# EAGLE design SparkFun_ProMicro_RP2350 (EAGLE 9.6.2)
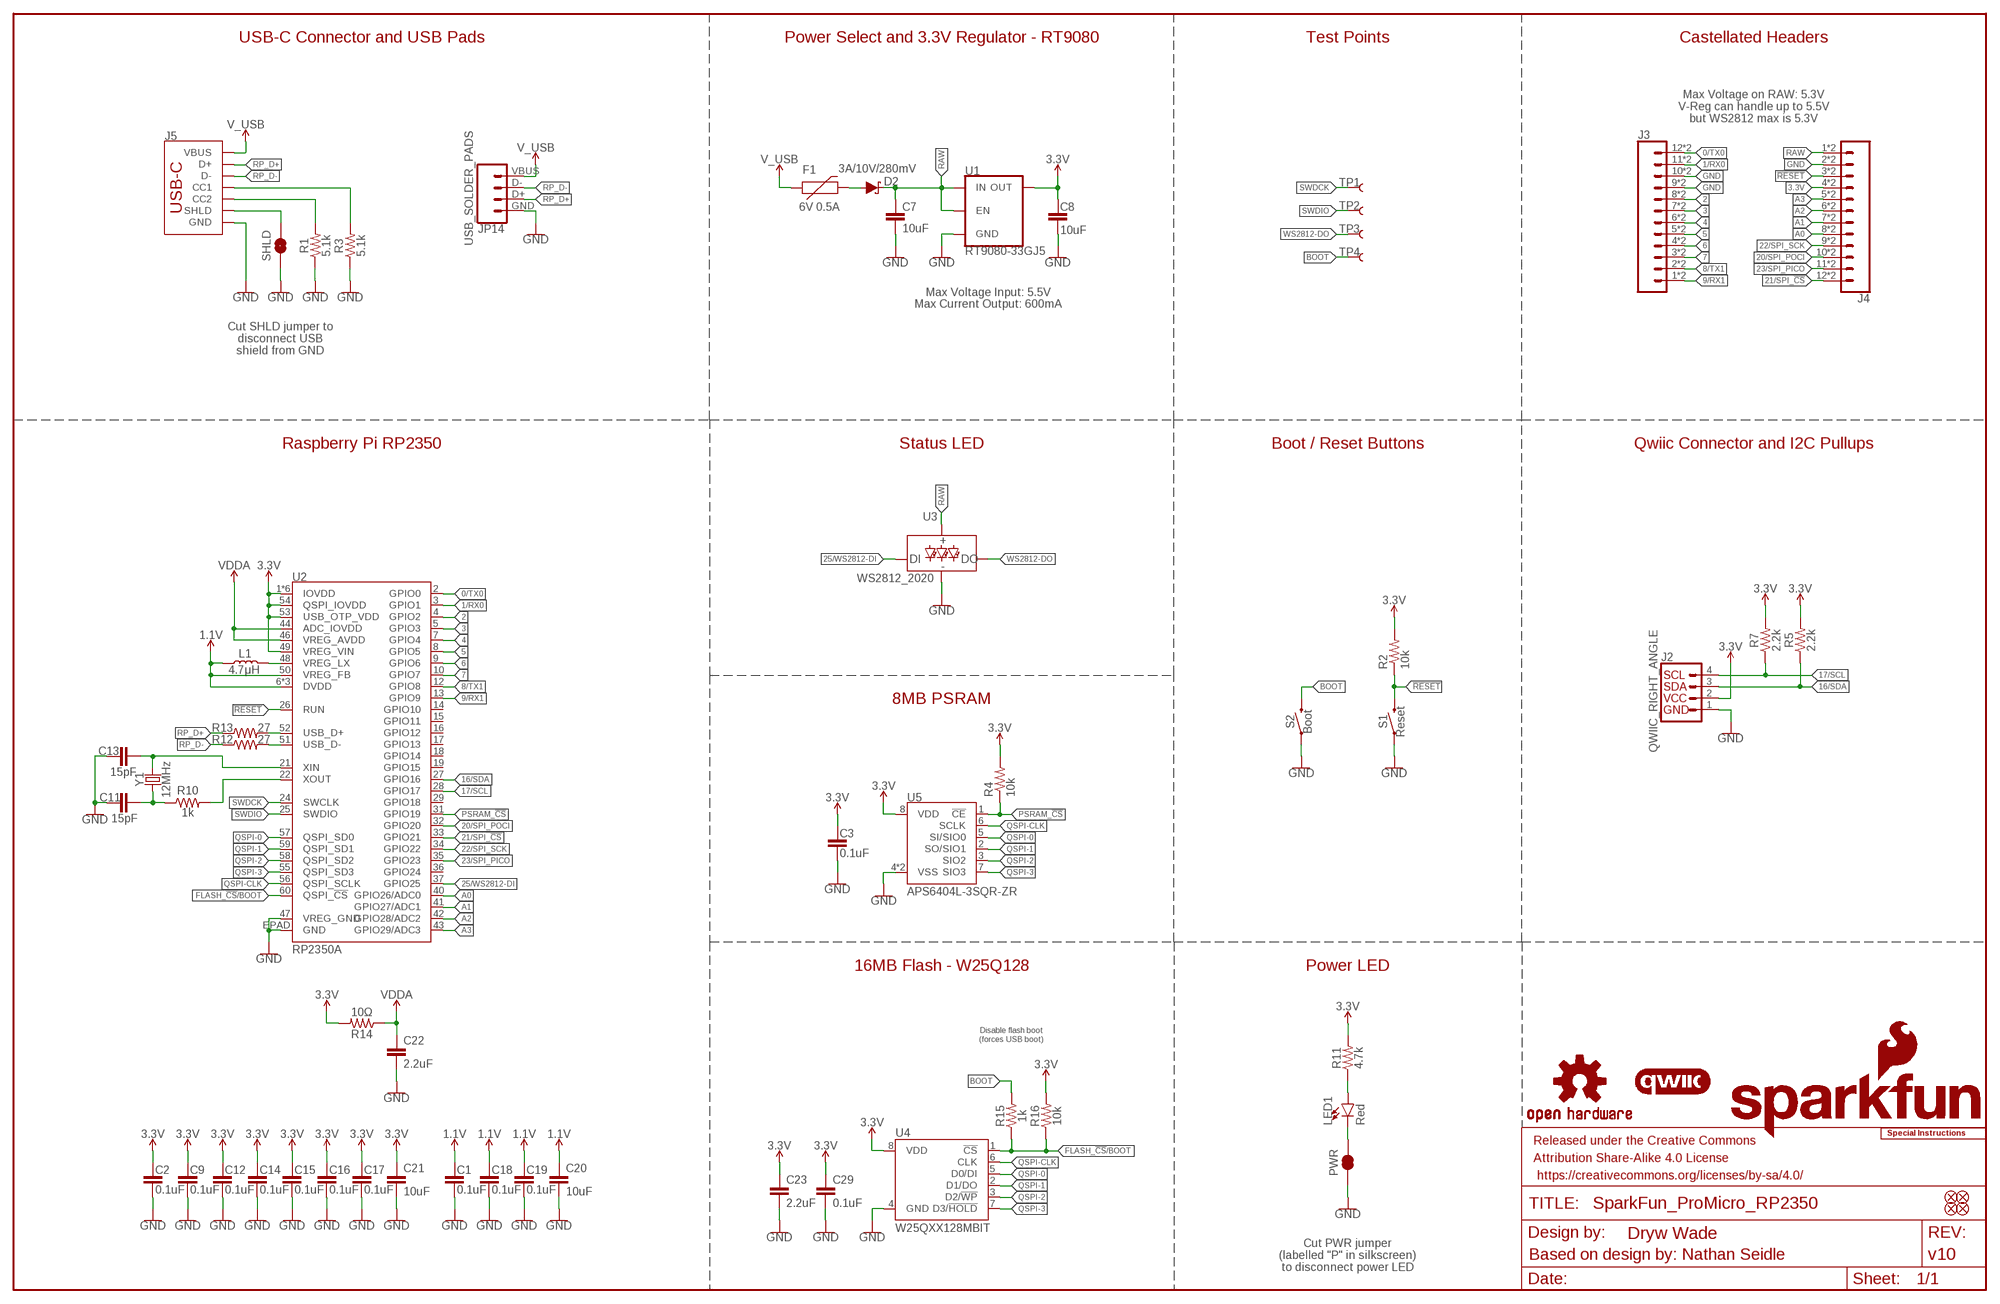
[diagram p0: schematic, sheet 1]

## Parts
C1  0.1uF  0.1UF-0402T-6.3V-10%-X7R  [0402-TIGHT]
C2  0.1uF  0.1UF-0402T-6.3V-10%-X7R  [0402-TIGHT]
C3  0.1uF  0.1UF-0402T-6.3V-10%-X7R  [0402-TIGHT]
C7  10uF  10UF-0402T-6.3V-20%  [0402-TIGHT]
C8  10uF  10UF-0402T-6.3V-20%  [0402-TIGHT]
C9  0.1uF  0.1UF-0402T-6.3V-10%-X7R  [0402-TIGHT]
C11  15pF  15PF-0402T-50V-5%  [0402-TIGHT]
C12  0.1uF  0.1UF-0402T-6.3V-10%-X7R  [0402-TIGHT]
C13  15pF  15PF-0402T-50V-5%  [0402-TIGHT]
C14  0.1uF  0.1UF-0402T-6.3V-10%-X7R  [0402-TIGHT]
C15  0.1uF  0.1UF-0402T-6.3V-10%-X7R  [0402-TIGHT]
C16  0.1uF  0.1UF-0402T-6.3V-10%-X7R  [0402-TIGHT]
C17  0.1uF  0.1UF-0402T-6.3V-10%-X7R  [0402-TIGHT]
C18  0.1uF  0.1UF-0402T-6.3V-10%-X7R  [0402-TIGHT]
C19  0.1uF  0.1UF-0402T-6.3V-10%-X7R  [0402-TIGHT]
C20  10uF  10UF-0402T-6.3V-20%  [0402-TIGHT]
C21  10uF  10UF-0402T-6.3V-20%  [0402-TIGHT]
C22  2.2uF  2.2UF-0402_TIGHT-10V-10%-X5R  [0402-TIGHT]
C23  2.2uF  2.2UF-0402_TIGHT-10V-10%-X5R  [0402-TIGHT]
C29  0.1uF  0.1UF-0402T-6.3V-10%-X7R  [0402-TIGHT]
D2  3A/10V/280mV  DIODE-SCHOTTKY-BAT60A  [SOD-323]
F1  6V 0.5A  PPTC_6V500MA  [0805]
FRAME2  FRAME-LEDGER  [CREATIVE_COMMONS]
J2  QWIIC_RIGHT_ANGLE  QWIIC_CONNECTORJS-1MM  [JST04_1MM_RA]
J3  CONN_12CASTELLATED  [1X12_CASTELLATED]
J4  CONN_12CASTELLATED  [1X12_CASTELLATED]
J5  USB Female Type C Connector  USB_C_4-LAYER_PADS  [USB-C-16P_4LAYER-PADS]
JP1  FIDUCIAL1X2  [FIDUCIAL-1X2]
JP2  FIDUCIAL1X2  [FIDUCIAL-1X2]
JP3  FIDUCIAL1X2  [FIDUCIAL-1X2]
JP4  FIDUCIAL1X2  [FIDUCIAL-1X2]
JP14  USB_SOLDER_PADS  [USB-SOLDER-PADS]
L1  4.7μH  4.7μH_SHIELDED_INDUCTOR  [1008(2520)]
LED1  Red  LED-RED_0603-KB  [LED-0603]
LOGO1  SFE_LOGO_NAME_FLAME.1_INCH  [SFE_LOGO_NAME_FLAME_.1]
LOGO3  QWIIC_LOGO_6MM  [QWIIC_6MM]
LOGO4  SFE_LOGO_FLAME.1_INCH  [SFE_LOGO_FLAME_.1]
LOGO5  SPECIAL_INSTRUCTIONS-ORDERING  [ORDERING_INSTRUCTIONS]
PWR  JUMPER-SMT_2_NC_TRACE_SILK  [SMT-JUMPER_2_NC_TRACE_SILK]
R1  5.1k  5.1KOHM-0402T-1/16W-1%  [0402-TIGHT]
R2  10k  10KOHM-0402T-1/16W-1%  [0402-TIGHT]
R3  5.1k  5.1KOHM-0402T-1/16W-1%  [0402-TIGHT]
R4  10k  10KOHM-0402T-1/16W-1%  [0402-TIGHT]
R5  2.2k  2.2KOHM-0402T-1/16W-1%  [0402-TIGHT]
R7  2.2k  2.2KOHM-0402T-1/16W-1%  [0402-TIGHT]
R10  1k  1KOHM-0402T-1/16W-1%  [0402-TIGHT]
R11  4.7k  4.7KOHM-0402T-1/16W-1%  [0402-TIGHT]
R12  27  27OHM  [0402-TIGHT]
R13  27  27OHM  [0402-TIGHT]
R14  10Ω  10OHM-0402-1/16W-5%  [0402-TIGHT]
R15  1k  1KOHM-0402T-1/16W-1%  [0402-TIGHT]
R16  10k  10KOHM-0402T-1/16W-1%  [0402-TIGHT]
S1  Reset  MOMENTARY-SWITCH-SPST-SMD-4.6X2.8MM  [TACTILE_SWITCH_SMD_4.6X2.8MM]
S2  Boot  MOMENTARY-SWITCH-SPST-SMD-4.6X2.8MM  [TACTILE_SWITCH_SMD_4.6X2.8MM]
SHLD  JUMPER-SMT_2_NC_TRACE_SILK  [SMT-JUMPER_2_NC_TRACE_SILK]
TP1  TEST-POINT3X5  [PAD.03X.05]
TP2  TEST-POINT3X5  [PAD.03X.05]
TP3  TEST-POINT3X5  [PAD.03X.05]
TP4  TEST-POINT3X5  [PAD.03X.05]
U1  RT9080-33GJ5  V_REG_RT9080-33GJ5  [SOT23-5]
U2  RP2350A  [RP2350A]
U3  WS2812_2020  [WS2812-2020]
U4  W25QXX128MBIT  W25QXX128MBIT-6X5-SKINNY_CENTER  [WSON-8-6X5-SKINNY_CENTERPAD]
U5  APS6404L-3SQR-ZR  [APS6404L-3SQR-ZR]
U$3  OSHW-LOGOMINI  [OSHW-LOGO-MINI]
Y1  12MHz  CRYSTAL-12MHZ  [CRYSTAL-SMD-2X2.5MM]

## Nets
0/TX0: J3.12 J3.12B U2.2(GPIO0)
1.1V: C1.1 C18.1 C19.1 C20.1 L1.1 U2.6(DVDD) U2.23(DVDD) U2.39(DVDD) U2.50(VREG_FB)
1/RX0: J3.11 J3.11B U2.3(GPIO1)
2: J3.8 J3.8B U2.4(GPIO2)
3: J3.7 J3.7B U2.5(GPIO3)
3.3V: C2.1 C3.1 C8.2 C9.1 C12.1 C14.1 C15.1 C16.1 C17.1 C21.1 C23.1 C29.1 J2.2 J4.4 J4.4B R2.2 R4.2 R5.2 R7.2 R11.2 R14.2 R16.2 U1.5(OUT) U2.1(IOVDD) U2.11(IOVDD) U2.20(IOVDD) U2.30(IOVDD) U2.38(IOVDD) U2.45(IOVDD) U2.49(VREG_VIN) U2.53(USB_OTP_VDD) U2.54(QSPI_IOVDD) U4.8(VDD) U5.8(VDD)
4: J3.6 J3.6B U2.7(GPIO4)
5: J3.5 J3.5B U2.8(GPIO5)
6: J3.4 J3.4B U2.9(GPIO6)
7: J3.3 J3.3B U2.10(GPIO7)
8/TX1: J3.2 J3.2B U2.12(GPIO8)
9/RX1: J3.1 J3.1B U2.13(GPIO9)
16/SDA: J2.3 R5.1 U2.27(GPIO16)
17/SCL: J2.4 R7.1 U2.28(GPIO17)
20/SPI_POCI: J4.10 J4.10B U2.32(GPIO20)
21/SPI_!CS!: J4.12 J4.12B U2.33(GPIO21)
22/SPI_SCK: J4.9 J4.9B U2.34(GPIO22)
23/SPI_PICO: J4.11 J4.11B U2.35(GPIO23)
25/WS2812-DI: U2.37(GPIO25) U3.DI
!RESET!: J4.3 J4.3B R2.1 S1.3 S1.4 U2.26(RUN)
A0: J4.8 J4.8B U2.40(GPIO26/ADC0)
A1: J4.7 J4.7B U2.41(GPIO27/ADC1)
A2: J4.6 J4.6B U2.42(GPIO28/ADC2)
A3: J4.5 J4.5B U2.43(GPIO29/ADC3)
BOOT: R15.2 S2.3 S2.4 TP4.1
FLASH_!CS!/BOOT: R15.1 R16.1 U2.60(QSPI_!CS!) U4.1(!CS!)
GND: C1.2 C2.2 C3.2 C7.1 C8.1 C9.2 C11.1 C12.2 C13.1 C14.2 C15.2 C16.2 C17.2 C18.2 C19.2 C20.2 C21.2 C22.2 C23.2 C29.2 J2.1 J3.9 J3.9B J3.10 J3.10B J4.2 J4.2B J5.GND J5.GND2(GND) JP14.GND PWR.1 R1.1 R3.1 S1.1 S1.2 S2.1 S2.2 SHLD.2 U1.2(GND) U2.47(VREG_GND) U2.EPAD(GND) U3.GND U4.4(GND) U5.4(VSS) U5.9(VSS)
N$2: L1.2 U2.48(VREG_LX)
N$3: LED1.C PWR.2
N$9: J5.A5(CC1) R3.2
N$10: J5.B5(CC2) R1.2
N$38: LED1.A R11.1
PSRAM_!CS!: R4.1 U2.31(GPIO19) U5.1(!CE!)
QSPI-0: U2.57(QSPI_SD0) U4.5(D0/DI) U5.5(SI/SIO0)
QSPI-1: U2.59(QSPI_SD1) U4.2(D1/DO) U5.2(SO/SIO1)
QSPI-2: U2.58(QSPI_SD2) U4.3(D2/!WP!) U5.3(SIO2)
QSPI-3: U2.55(QSPI_SD3) U4.7(D3/!HOLD!) U5.7(SIO3)
QSPI-CLK: U2.56(QSPI_SCLK) U4.6(CLK) U5.6(SCLK)
RAW [Power]: C7.2 D2.C J4.1 J4.1B U1.1(IN) U1.3(EN) U3.VCC
RP_D1+: R13.2 U2.52(USB_D+)
RP_D1-: R12.2 U2.51(USB_D-)
RP_D+: J5.A6(D+) J5.B6(D+) JP14.D+ R13.1
RP_D-: J5.A7(D-) J5.B7(D-) JP14.D- R12.1
SHLD: J5.SHLD1(SHLD) J5.SHLD2(SHLD) J5.SHLD3(SHLD) J5.SHLD4(SHLD) SHLD.1
SWDCK: TP1.1 U2.24(SWCLK)
SWDIO: TP2.1 U2.25(SWDIO)
USB_RAW [Power]: D2.A F1.2
V_USB [Power]: F1.1 J5.VBUS1(VBUS) J5.VBUS2(VBUS) JP14.VBUS
VDDA: C22.1 R14.1 U2.44(ADC_IOVDD) U2.46(VREG_AVDD)
WS2812-DO: TP3.1 U3.DO
X1A: R10.2 U2.22(XOUT)
X1B: C11.2 R10.1 Y1.P1
X2: C13.2 U2.21(XIN) Y1.P3
Unconnected: U2.14(GPIO10) U2.15(GPIO11) U2.16(GPIO12) U2.17(GPIO13) U2.18(GPIO14) U2.19(GPIO15) U2.29(GPIO18) U2.36(GPIO24)

## Notes on the sheet
- USB-C Connector and USB Pads | Power Select and 3.3V Regulator - RT9080 | Test Points | Castellated Headers
- Max Voltage on RAW: 5.3V
  V-Reg can handle up to 5.5V
  but WS2812 max is 5.3V
- Max Voltage Input: 5.5V
- Max Current Output: 600mA
- Cut SHLD jumper to
  disconnect USB
  shield from GND
- Raspberry Pi RP2350 | Status LED | Boot / Reset Buttons | Qwiic Connector and I2C Pullups
- 8MB PSRAM
- 16MB Flash - W25Q128 | Power LED
- Disable flash boot
  (forces USB boot)
- Cut PWR jumper
  (labelled "P" in silkscreen)
  to disconnect power LED
- Based on design by: Nathan Seidle

## Library data of the parts
C1-C3 C9 C12 C14-C19 C29 = SparkFun-Capacitors:0.1UF: 0.1µF ceramic capacitors A capacitor is a passive two-terminal electrical component used to store electrical energy temporarily in an electric field.; PROD_ID: CAP-14993
C7 C8 C20 C21 = SparkFun-Capacitors:10UF: 10.0µF ceramic capacitors A capacitor is a passive two-terminal electrical component used to store electrical energy temporarily in an electric field.; PROD_ID: CAP-14848
C11 C13 = SparkFun-Capacitors:15PF: 15pF ceramic capacitors A capacitor is a passive two-terminal electrical component used to store electrical energy temporarily in an electric field.; PROD_ID: CAP-13063
C22 C23 = SparkFun-Capacitors:2.2UF: 2.2µF ceramic capacitors A capacitor is a passive two-terminal electrical component used to store electrical energy temporarily in an electric field.; PROD_ID: CAP-14232
D2 = SparkFun-DiscreteSemi:DIODE-SCHOTTKY: Schottky diode A Schottky diode is a semiconductor diode which has a low forward voltage drop and a very fast switching action.; PROD_ID: DIO-14072
F1 = SparkFun-Fuses:PPTC: Resettable Fuse PPTC Resettable Fuse. Really a sort of resistor with a polymeric positive temperature coefficient whose resistance increases dramatically with an increase in temperature. When heated by the power passing through the resistance rises causing the current to be limited, protecting the circuit. This is achieved by the transition of the polymer from a crystalline to an amorphous state where the conductive carbon separates breaking the conductive pathways found in the cool crystalline structure. When a PPTC cools back down it resumes conducting letting the circuit turn back on. SparkFun Products: SparkFun RedBoard - Programmed with Arduino <https://www.sparkfun.com/products/12757> Pro Micro - 5V/16MHz <https://www.sparkfun.com/products/12640> Arduino Pro 328 - 5V/16MHz <https://www.sparkfun.com/products/10915> MP3 Trigger <https://www.sparkfun.com/products/13720>; PROD_ID: RES-13945
FRAME2 = SparkFun-Aesthetics:FRAME-LEDGER: Schematic Frame - Ledger Standard 11x14 US Ledger frame; DESIGNER: Dryw Wade; REV: v10
J2 = SparkFun-Connectors:QWIIC_CONNECTOR: SparkFun I2C Standard Qwiic Connector An SMD 1mm pitch JST connector makes it easy and quick (get it? Qwiic?) to connect I2C devices to each other. The Qwiic system <http://www.sparkfun.com/qwiic> enables fast and solderless connection between popular platforms and various sensors and actuators. We carry 200mm <https://www.sparkfun.com/products/14204>, 100mm <https://www.sparkfun.com/products/14205>, 50mm <https://www.sparkfun.com/products/14206>, and breadboard friendly <https://www.sparkfun.com/products/14207> Qwiic cables. We also offer 10 pcs strips <https://www.sparkfun.com/products/14323> the SMD connectors.; PROD_ID: CONN-13694
J3 J4 = SparkFun-Connectors:CONN_12: Multi connection point. Often used as Generic Header-pin footprint for 0.1 inch spaced/style header connections On any of the 0.1 inch spaced packages, you can populate with these: Break Away Headers - Straight <https://www.sparkfun.com/products/116> (PRT-00116) Break Away Male Headers - Right Angle <https://www.sparkfun.com/products/553> (PRT-00553) Female Headers <https://www.sparkfun.com/products/115> (PRT-00115) Break Away Headers - Machine Pin <https://www.sparkfun.com/products/117> (PRT-00117) Break Away Female Headers - Swiss Machine Pin <https://www.sparkfun.com/products/743> (PRT-00743) For SCREWTERMINALS and SPRING TERMINALS visit here: Screw Terimnals on SparkFun.com <https://www.sparkfun.com/search/results?term=Screw+Terminals> (5mm/3.5mm/2.54mm spacing) This device is also useful as a general connection point to wire up your design to another part of your project. Our various solder wires solder well into these plated through hole pads. Hook-Up Wire - Assortment (Stranded, 22 AWG) <https://www.sparkfun.com/products/11375> (PRT-11375) Hook-Up Wire - Assortment (Solid Core, 22 AWG) <https://www.sparkfun.com/products/11367> (PRT-11367) View the entire wire category on our website here <https://www.sparkfun.com/categories/141> Special notes: Molex polarized connector foot print use with SKU : PRT-08231 with associated crimp pins and housings. 1MM SMD Version SKU: PRT-10208 NOTES ON THE VARIANTS LOCK and LOCK_LONGPADS... This footprint was designed to help hold the alignment of a through-hole component (i.e. 6-pin header) while soldering it into place. You may notice that each hole has been shifted either up or down by 0.005 of an inch from it's more standard position (which is a perfectly straight line). This slight alteration caused the pins (the squares in the middle) to touch the edges of the holes. Because they are alternating, it causes a "brace" to hold the component in place. 0.005 has proven to be the perfect amount of "off-center" position when using our standard breakaway headers. Although looks a little odd when you look at the bare footprint, once you have a header in there, the alteration is very hard to notice. Also,if you push a header all the way into place, it is covered up entirely on the bottom side.
J5 = SparkFun-Connectors:USB_C: USB Type C 16Pin Connector Super Speed pins not available on the 16-pin purely SMD connector so this part is best for USB 2.0 implementations. D1 and D2 are tied together enabling D+/- no matter which way the cable is plugged into the connector. The two channel configuration pins (CC1/2) are exposed. These are normally connected to ground via 5.1k resistors but can be reconfigured for high current/high power applications. **4-LAYER BOARD WARNING!!** If designing 4-layer board, make sure to select the variant _4-LAYER-ISOLATED. The linked footprint (USB-C-16-4LAYER-ISOLATED) includes some very necessary cutout polygons in the inner layers (2 and 15). This prevents the PTH mounting shield legs on the USB connector from electrically connecting any other polygons on the inner layers (usually VCC and GND).; PROD_ID: CONN-14122
JP1-JP4 = SparkFun-Aesthetics:FIDUCIAL: Fiducial Alignment Points Point-of-reference for pick-and-place machines and other optical instruments.
JP14 = SparkFun-Connectors:USB_SOLDER_PADS: Solder pad access to USB pins. Helpful to expose on PCBs so user can attach external USB connector if necessary.
L1 = SparkFun-Coils:4.7μH_SHIELDED_INDUCTOR: 4.7uH Inductor 4.7uH 1.4A 50mOhm 1008(2520) Package Shielded; PROD_ID: NDUC-14880
LED1 = SparkFun-LED:LED-RED: Red SMD LED Used in manufacturing of most products at SparkFun Packages: 0603 - KB - KingBright (DIO-17976) SMD 0603 package [Datasheet] <https://www.kingbrightusa.com/images/catalog/SPEC/APT1608SURCK.pdf> 0603 - (DIO-00819, has gone EOL) SMD 0603 package 0603 SMART - SMD 0603 SMART package ( more efficient and expensive)[Product Link] <http://www.osram-os.com/Graphics/XPic2/00077099_0.pdf> 1206 - SMD1206 package [Product Link] <https://www.sparkfun.com/datasheets/DevTools/LilyPad/Q150OVS4.pdff> SparkFun Products: Pro Mini 328 -5V <https://www.sparkfun.com/products/821> RedBoard <https://www.sparkfun.com/products/12757> IOIO-OTG <https://www.sparkfun.com/products/13613>; PROD_ID: DIO-17976
LOGO1 = SparkFun-Aesthetics:SFE_LOGO_NAME_FLAME: SparkFun Font Logo w/ Flame This is the SparkFun full logo. The logo on the schematic will always be the same size; the package variant is the height of the flame part of the logo. Default layer for the logo on the board is tSilk.
LOGO3 = SparkFun-Aesthetics:QWIIC_LOGO: Qwiic Logos for placement on schematic and PCB. The 5.5mm silk logo is best for placing next to Qwiic connector.
LOGO4 = SparkFun-Aesthetics:SFE_LOGO_FLAME: SparkFun Flame Logo This is the SparkFun flame logo. The logo on the schematic will always be the same size; the package variant is the height of the flame. Default layer for the logo on the board is tSilk.
LOGO5 = SparkFun-Aesthetics:SPECIAL_INSTRUCTIONS: Special Ordering/Production Instructions Alert Symbol for special PCB ordering instructions or unique production process warnings. Ordering Instructions Production Instructions Types of information that should be added to box: Copper weight Soldermask color Silk color PCB thickness Number of layers PCB Standard: 1.6mm FR4 1 oz copper immersion silver plating red soldermask white silkscreen Types of information that should be added to box: Special wash requirements Depaneling instructions Humidification Glue curing Default text settings: 0.07 inch 9% ratio 50% line distance
PWR SHLD = SparkFun-Jumpers:JUMPER-SMT_2_NC_TRACE: Normally closed trace jumper This jumper has a trace between two pads so it's normally closed (NC). Use a razor knife to open the connection. For best results follow the IPC guidelines for cutting traces: Cutout at least 0.063 mm (0.005 in). Remove all loose material to clean up the cut area. Seal the cut with an approved epoxy. Reapply solder to reclose the connection.
R1 R3 = SparkFun-Resistors:5.1KOHM; PROD_ID: RES-14340
R2 R4 R16 = SparkFun-Resistors:10KOHM: 10kΩ resistor A resistor is a passive two-terminal electrical component that implements electrical resistance as a circuit element. Resistors act to reduce current flow, and, at the same time, act to lower voltage levels within circuits. - Wikipedia; PROD_ID: RES-14241
R5 R7 = SparkFun-Resistors:2.2KOHM: 2.2kΩ resistor A resistor is a passive two-terminal electrical component that implements electrical resistance as a circuit element. Resistors act to reduce current flow, and, at the same time, act to lower voltage levels within circuits. - Wikipedia; PROD_ID: RES-14341
R10 R15 = SparkFun-Resistors:1KOHM: 1kΩ resistor A resistor is a passive two-terminal electrical component that implements electrical resistance as a circuit element. Resistors act to reduce current flow, and, at the same time, act to lower voltage levels within circuits. - Wikipedia; PROD_ID: RES-14342
R11 = SparkFun-Resistors:4.7KOHM: 4.7kΩ resistor A resistor is a passive two-terminal electrical component that implements electrical resistance as a circuit element. Resistors act to reduce current flow, and, at the same time, act to lower voltage levels within circuits. - Wikipedia; PROD_ID: RES-15343
R12 R13 = SparkFun-Resistors:27OHM: 27Ω resistor A resistor is a passive two-terminal electrical component that implements electrical resistance as a circuit element. Resistors act to reduce current flow, and, at the same time, act to lower voltage levels within circuits. - Wikipedia; PROD_ID: RES-15238
R14 = SparkFun-Resistors:10OHM: 10Ω resistor A resistor is a passive two-terminal electrical component that implements electrical resistance as a circuit element. Resistors act to reduce current flow, and, at the same time, act to lower voltage levels within circuits. - Wikipedia; PROD_ID: RES-16072
S1 S2 = SparkFun-Switches:MOMENTARY-SWITCH-SPST: Momentary Switch (Pushbutton) - SPST Normally-open (NO) SPST momentary switches (buttons, pushbuttons). Variants PTH-12MM - 12mm square, through-hole Momentary Pushbutton Switch - 12mm Square <https://www.sparkfun.com/products/9190> (COM-09190) PTH-6.0MM, PTH-6.0MM-KIT - 6.0mm square, through-hole Mini Pushbutton Switch <https://www.sparkfun.com/products/97> (COM-00097) KIT package intended for soldering kit's - only one side of pads' copper is exposed. PTH-RIGHT-ANGLE-KIT - Right-angle, through-hole Right Angle Tactile Button <https://www.sparkfun.com/products/10791> - Used on SparkFun BigTime Watch Kit <https://www.sparkfun.com/products/11734> SMD-12MM - 12mm square, surface-mount Tactile Button - SMD (12mm) <https://www.sparkfun.com/products/12993> (COM-12993) Used on SparkFun PicoBoard <https://www.sparkfun.com/products/11888> SMD-4.5MM - 4.5mm Square Trackball Switch Used on SparkFun Blackberry Trackballer Breakout <https://www.sparkfun.com/products/13169> SMD-4.6MMX2.8MM - 4.60mm x 2.80mm, surface mount Used on SparkFun Pro Micro - RP2040 <https://www.sparkfun.com/products/17717> SMD-5.2MM, SMD-5.2-REDUNDANT - 5.2mm square, surface-mount Mini Pushbutton Switch - SMD <https://www.sparkfun.com/products/8720> (COM-08720) Used on Arduino Pro Mini <https://www.sparkfun.com/products/11114> REDUNDANT package connects both switch circuits together SMD-6.0X3.5MM - 6.0 x 3.5mm, surface mount Momentary Reset Switch SMD <https://www.sparkfun.com/products/8229> (COM-08229) SMD-6.2MM-TALL - 6.2mm square, surface mount Tactile Button - SMD (6mm) <https://www.sparkfun.com/products/12992> Used on SparkFun Digital Sandbox <https://www.sparkfun.com/products/12651> SMD-RIGHT-ANGLE - Right-angle, surface mount Used on SparkFun Block for Intel® Edison - Arduino <https://www.sparkfun.com/products/13036>; PROD_ID: SWCH-15606
TP1-TP4 = SparkFun-Connectors:TEST-POINT: SparkFun Test Points Bare copper test points for troubleshooting or In-Circuit-Testing. These are used by our Production team for verifying production board runs using pogo-pins on test beds. SparkFun Products: SparkFun LSM9DS1 Breakout <https://www.sparkfun.com/products/13284> SparkFun PSOC <https://www.sparkfun.com/products/13714> SparkFun Load Cell Amplifier <https://www.sparkfun.com/products/13879>
U1 = SparkFun-IC-Power:V_REG_RT9080-33GJ5: RT9080-33GJ5 Low-Dropout Linear Regulator The RT9080 is a low-dropout (LDO) voltage regulators with enable function that operates from 1.2V to 5.5V. It provides up to 600mA of output current and offers low-power operation in miniaturized packaging. The features of low quiescent current as low as 2μA and almost zero disable current is ideal for powering the battery equipment to a longer service life. The RT9080 is stable with the ceramic output capacitor over its wide input range from 1.2V to 5.5V and the entire range of output load current (0mA to 600mA). The output for this LDO is 3.3V.; PROD_ID: VREG-19034
U2 = RP2350A:RP2350A; PROD_ID: IC-21276
U3 = SparkFun-LED:WS2812: Addressable RGB LED - 1 Wire Common names: WS2812, SK6812, Neopixel, APA-106, etc. SMD LED with built-in controller IC. Color: Red/Green/Blue SparkFun Products: LED-SMD RGB (WS2812) <https://www.sparkfun.com/products/12661> LED - RGB Addressable, PTH, 5mm Diffused (5 Pack) <https://www.sparkfun.com/products/12986> LED - RGB Addressable, PTH, 5mm Clear (5 Pack) <https://www.sparkfun.com/products/12999> RGB Addressable CBI LED 5mm RA <https://www.sparkfun.com/products/23649> Datasheet referenced for footprint: WS2812B-PTH <https://cdn.sparkfun.com/datasheets/Components/LED/COM-12877.pdf>; PROD_ID: DIO-15591
U4 = SparkFun-IC-Memory:W25QXX; PROD_ID: IC-15107
U5 = RP2350A:APS6404L-3SQR-ZR; PROD_ID: IC-21870
U$3 = SparkFun-Aesthetics:OSHW-LOGO: Open-Source Hardware (OSHW) Logo This logo indicates the piece of hardware it is found on incorporates a OSHW license and/or adheres to the definition of open source hardware found here: http://freedomdefined.org/OSHW
Y1 = SparkFun-Clocks:CRYSTAL-12MHZ: 12.0MHz Crystal Frequency: 12.0MHz Frequency Tolerance: ±20ppm Load Capacitance: 18pF SparkFun Products: SparkFun Logomatic <https://www.sparkfun.com/products/12772> Pocket AVR Programmer <https://www.sparkfun.com/products/9825>; PROD_ID: XTAL-15540

## Net classes
1 Power: width 0.127 mm, clearance 0.178 mm

## Board
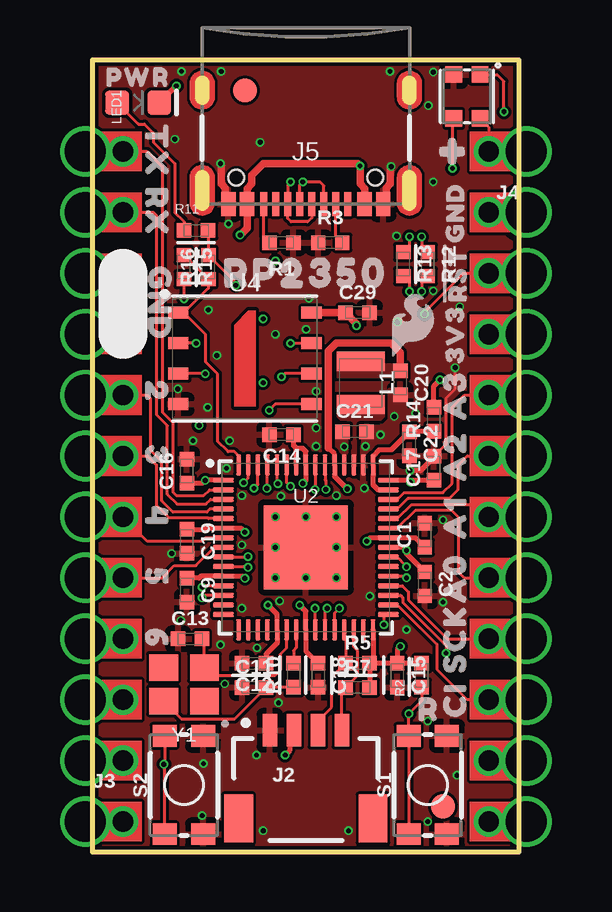
[diagram p1: board, top side]
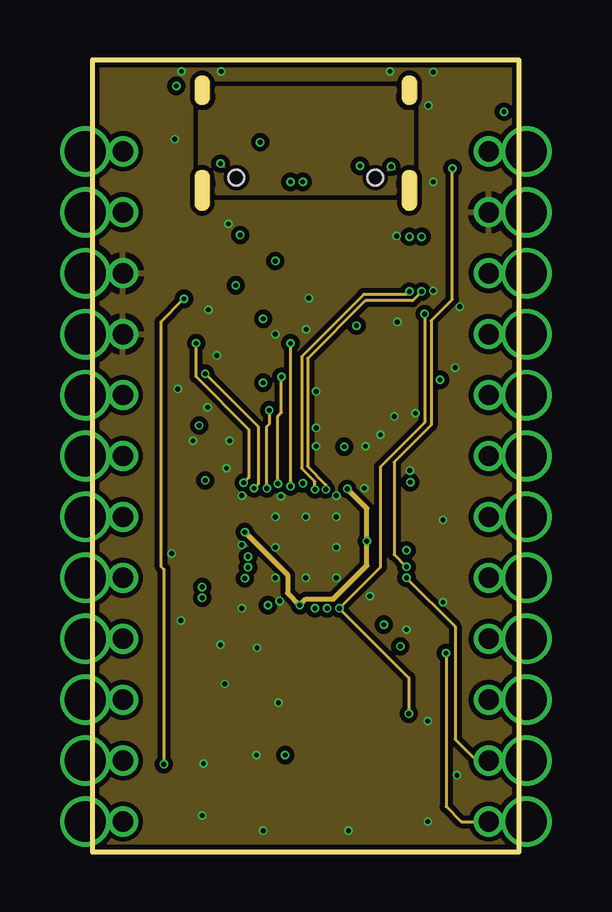
[diagram p2: board, inner layer GND/Vert]
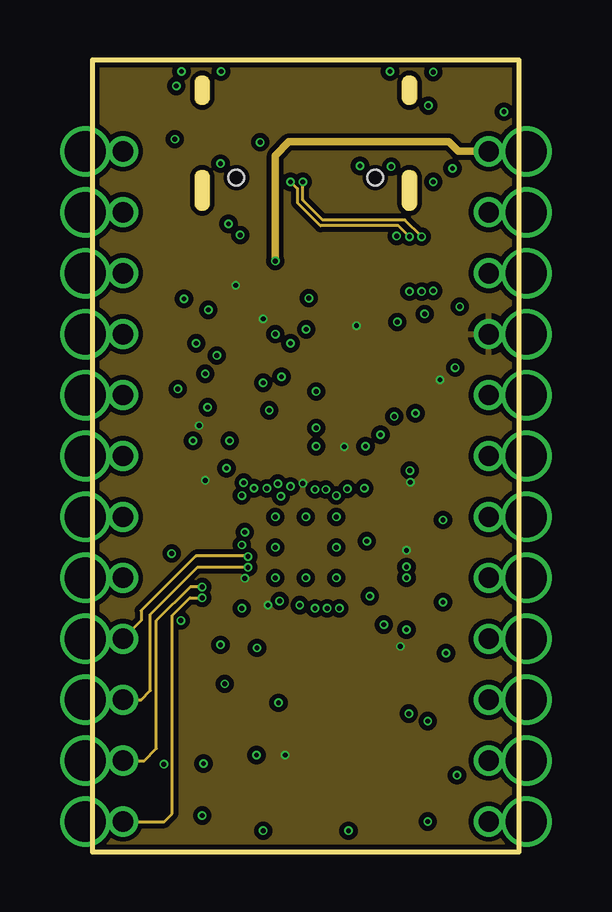
[diagram p3: board, inner layer 3.3V/Horz]
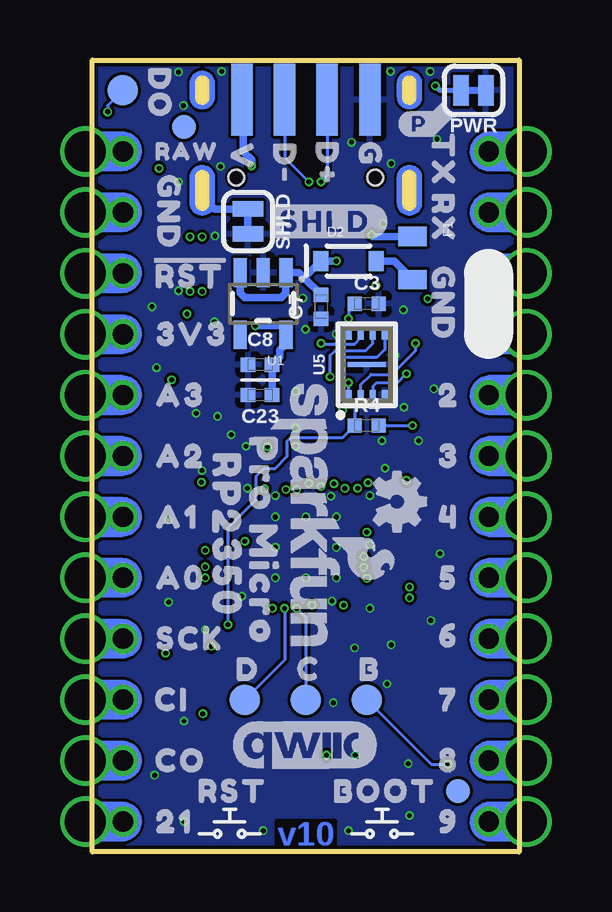
[diagram p4: board, bottom side, seen from below]

Size 17.78 x 33.02 mm. Coordinates in mm from the lower left corner, seen from the top.
Outline: 0,33.02 0,0 17.78,0 17.78,33.02 0,33.02
Copper layers (1+2*15+16): Top 0.035mm / dielectric 1.5mm / GND/Vert 0.035mm / dielectric 0.15mm / 3.3V/Horz 0.035mm / dielectric 0.2mm / Bottom 0.035mm
Design rules "SparkFun-4-layer-MicroMod *": minimum track width 4mil, minimum drill 0.2mm, track to track 4mil, track to pad 4mil, pad to pad 4mil, via to via 4mil, smd to smd 4mil, copper to edge 6mil, drill to drill 6mil, minimum pad ring 3mil, minimum via ring 3mil, stop-mask expansion 4mil, vias tented up to drill 25mil, thermal gap 10mil

### Footprints (pad centres in the part's own frame; a part is rotated, then mirrored left to right if it is on the bottom)
0402-TIGHT = smd 0.6 x 0.6: 1 -0.5,0; 2 0.5,0
SOD-323 = smd 0.63 x 0.83: A 1.15,0; C -1.15,0
0805 = smd 0.8 x 1.2: 1 -0.9,0; 2 0.9,0
JST04_1MM_RA = smd 0.6 x 1.35: 1 -1.5,0; 2 -0.5,0; 3 0.5,0; 4 1.5,0 | smd 1.2 x 2: NC1 2.8,-3.675; NC2 -2.8,-3.675
1X12_CASTELLATED = drill 0.85 pad 1.016: 1 0,0; 2 0,2.54; 3 0,5.08; 4 0,7.62; 5 0,10.16; 6 0,12.7; 7 0,15.24; 8 0,17.78; 9 0,20.32; 10 0,22.86; 11 0,25.4; 12 0,27.94 | drill 1.7 pad 1.75: 1B -1.57,0; 2B -1.57,2.54; 3B -1.57,5.08; 4B -1.57,7.62; 5B -1.57,10.16; 6B -1.57,12.7; 7B -1.57,15.24; 8B -1.57,17.78; 9B -1.57,20.32; 10B -1.57,22.86; 11B -1.57,25.4; 12B -1.57,27.94
USB-C-16P_4LAYER-PADS = smd 0.3 x 1: A5 -1.25,-0.34; A6 -0.25,-0.34; A7 0.25,-0.34; A8 1.25,-0.34; B5 1.75,-0.34; B6 0.75,-0.34; B7 -0.75,-0.34; B8 -1.75,-0.34 | smd 0.6 x 1: GND -3.225,-0.34; GND2 3.225,-0.34; VBUS1 -2.45,-0.34; VBUS2 2.45,-0.34 | drill 0.4 pad 0.6 long: SHLD1 -4.318,-0.915; SHLD2 4.318,-0.915; SHLD3 -4.318,-5.095; SHLD4 4.318,-5.095 | hole 0.65: -2.89,-1.445; 2.89,-1.445
FIDUCIAL-1X2 = smd 1 x 1: 1 0,0
USB-SOLDER-PADS = smd 3 x 0.9: D+ 0,-0.889; D- 0,0.889; GND 0,-2.667; VBUS 0,2.667
1008(2520) = smd 0.8 x 2: 1 -0.9,0; 2 0.9,0
LED-0603 = smd 1 x 1: A -0.877,0; C 0.877,0
SMT-JUMPER_2_NC_TRACE_SILK = smd 0.66 x 1.27: 1 -0.521,0; 2 0.521,0
TACTILE_SWITCH_SMD_4.6X2.8MM = smd 0.9 x 1: 1 -2.05,-0.8; 2 2.05,-0.8; 3 2.05,0.8; 4 -2.05,0.8
PAD.03X.05 = smd 1.27 x 1.27: 1 0,0
SOT23-5 = smd 0.55 x 1.2: 1 -0.95,-1.3; 2 0,-1.3; 3 0.95,-1.3; 4 0.95,1.3; 5 -0.95,1.3
RP2350A = smd 0.875 x 0.2: 1 -3.437,2.8; 2 -3.437,2.4; 3 -3.437,2; 4 -3.437,1.6; 5 -3.437,1.2; 6 -3.437,0.8; 7 -3.437,0.4; 8 -3.437,0; 9 -3.437,-0.4; 10 -3.437,-0.8; 11 -3.437,-1.2; 12 -3.437,-1.6; 13 -3.437,-2; 14 -3.437,-2.4; 15 -3.437,-2.8; 31 3.437,-2.8; 32 3.437,-2.4; 33 3.437,-2; 34 3.437,-1.6; 35 3.437,-1.2; 36 3.437,-0.8; 37 3.437,-0.4; 38 3.437,0; 39 3.437,0.4; 40 3.437,0.8; 41 3.437,1.2; 42 3.437,1.6; 43 3.437,2; 44 3.437,2.4; 45 3.437,2.8 | smd 0.2 x 0.875: 16 -2.8,-3.437; 17 -2.4,-3.437; 18 -2,-3.437; 19 -1.6,-3.437; 20 -1.2,-3.437; 21 -0.8,-3.437; 22 -0.4,-3.437; 23 0,-3.437; 24 0.4,-3.437; 25 0.8,-3.437; 26 1.2,-3.437; 27 1.6,-3.437; 28 2,-3.437; 29 2.4,-3.437; 30 2.8,-3.437; 46 2.8,3.437; 47 2.4,3.437; 48 2,3.437; 49 1.6,3.437; 50 1.2,3.437; 51 0.8,3.437; 52 0.4,3.437; 53 0,3.437; 54 -0.4,3.437; 55 -0.8,3.437; 56 -1.2,3.437; 57 -1.6,3.437; 58 -2,3.437; 59 -2.4,3.437; 60 -2.8,3.437 | smd 3.5 x 3.5: EPAD 0,0
WS2812-2020 = smd 0.7 x 0.7: DI -0.915,0.55; DO 0.915,-0.55; GND 0.915,0.55; VCC -0.915,-0.55
WSON-8-6X5-SKINNY_CENTERPAD = smd 0.85 x 0.5: 1 -2.775,1.905; 2 -2.775,0.635; 3 -2.775,-0.635; 4 -2.775,-1.905; 5 2.775,-1.905; 6 2.775,-0.635; 7 2.775,0.635; 8 2.775,1.905
APS6404L-3SQR-ZR = smd 0.4 x 0.25: 1 -1.25,0.75; 2 -1.25,0.25; 3 -1.25,-0.25; 4 -1.25,-0.75; 5 1.25,-0.75; 6 1.25,-0.25; 7 1.25,0.25; 8 1.25,0.75 | smd 0.2 x 1.6: 9 0,0
CRYSTAL-SMD-2X2.5MM = smd 1.2 x 1.1: P1 0.846,0.69; P2 -0.854,0.69; P3 -0.854,-0.71; P4 0.846,-0.71

### Placement (x,y rotation side)
C1  13.84,13.21 90 top
C2  13.84,11.18 270 top
C3  6.35,22.86 0 bottom
C7  8.26,22.73 90 bottom
C8  10.79,20.32 0 bottom
C9  3.94,10.92 270 top
C11  6.73,6.86 0 top
C12  6.73,7.87 180 top
C13  4.06,8.89 0 top
C14  7.87,17.4 180 top
C15  12.7,7.37 270 top
C16  3.94,15.88 90 top
C17  14.22,16 90 top
C18  9.4,7.37 270 top
C19  3.94,12.95 270 top
C20  12.83,19.56 270 top
C21  10.92,17.53 0 top
C22  13.21,17.02 270 top
C23  10.79,19.05 180 bottom
C29  11.05,22.48 0 top
D2  7.11,24.64 0 bottom
F1  4.45,24.77 270 bottom
FRAME2  39.37,-7.62 0 top  (outside the outline)
J2  8.89,5.08 0 top
J3  1.27,1.27 0 top
J4  16.51,29.21 180 top
J5  8.89,26.67 180 top
JP1  14.61,1.91 0 top
JP2  6.35,31.75 0 top
JP3  13.97,30.23 0 bottom
JP4  2.54,2.54 180 bottom
JP14  8.89,31.37 90 bottom
L1  11.18,19.56 270 top
LED1  1.91,31.24 0 top
LOGO1  8.89,13.97 270 bottom
LOGO3  8.89,4.45 0 bottom
LOGO4  13.34,21.97 0 top
LOGO5  22.86,50.8 0 top  (outside the outline)
PWR  1.91,31.75 180 bottom
R1  7.87,25.4 180 top
R2  13.72,7.37 90 top
R3  9.91,25.4 0 top
R4  6.35,17.78 0 bottom
R5  11.05,7.87 0 top
R7  11.05,6.86 0 top
R10  8.38,7.37 90 top
R11  4.32,25.91 0 top
R12  13.97,24.51 270 top
R13  12.95,24.51 270 top
R14  14.22,18.03 90 top
R15  3.81,24.38 270 top
R16  4.83,24.38 90 top
S1  13.97,2.79 90 top
S2  3.81,2.79 90 top
SHLD  11.3,26.29 270 bottom
TP1  8.89,6.35 0 bottom
TP2  11.43,6.35 0 bottom
TP3  16.51,31.75 0 bottom
TP4  6.35,6.35 0 bottom
U1  10.67,22.86 180 bottom
U2  8.89,12.7 0 top
U3  15.6,31.5 90 top
U4  6.35,20.57 0 top
U5  6.35,20.32 90 bottom
U$1  [A00]  15.11,11.43 90 top
U$2  [GND_0]  15.11,26.8 90 top
U$3  5.08,14.61 270 bottom
U$4  [PRO_MICRO0]  10.67,12.95 270 bottom
U$5  [#0]  15.1,29.2 0 top
U$6  [70]  2.92,6.35 0 bottom
U$7  [81]  2.92,3.81 0 bottom
U$8  [92]  2.92,1.27 0 bottom
U$9  [CI4]  14.48,6.35 0 bottom
U$10  [SCK3]  13.72,8.89 0 bottom
U$11  [A00]  14.1,11.43 0 bottom
U$12  [A10]  14.22,13.97 0 bottom
U$13  [A21]  14.1,16.51 0 bottom
U$14  [A32]  14.1,19.05 0 bottom
U$15  [GND2]  14.61,26.67 270 bottom
U$16  [3V3_0]  13.46,21.59 0 bottom
U$17  [RAW0]  13.84,29.21 0 bottom
U$18  [C0]  8.76,7.62 0 bottom
U$19  [TX0]  3.17,28.83 270 bottom
U$20  [A10]  15.11,13.97 90 top
U$21  [RX1]  3.17,26.42 270 bottom
U$22  [GND2]  3.17,22.86 270 bottom
U$23  [20]  2.92,19.05 0 bottom
U$24  [31]  2.92,16.51 0 bottom
U$25  [42]  2.92,13.97 0 bottom
U$26  [53]  2.92,11.43 0 bottom
U$27  [64]  2.92,9.02 0 bottom
U$28  [D#1]  8,28.7 270 bottom
U$29  [D#2]  9.78,28.7 270 bottom
U$30  [G0]  6.22,29.08 270 bottom
U$31  [V3]  11.56,28.96 270 bottom
U$32  [210]  14.35,1.27 0 bottom
U$33  [A21]  15.11,16.51 90 top
U$34  [#RST#0]  13.72,24.13 0 bottom
U$35  [D1]  11.3,7.62 0 bottom
U$36  [#P#0]  3.3,30.35 0 bottom
U$37  [R0]  14.02,5.94 0 top
U$38  [B0]  6.22,7.62 0 bottom
U$39  [A32]  15.11,19.05 90 top
U$40  [DO0]  14.99,31.62 270 bottom
U$41  [BOOT0]  5.59,2.54 0 bottom
U$42  [RP23500]  12.19,13.21 270 bottom
U$43  [#SHLD#0]  10.67,26.29 0 bottom
U$44  [RST0]  11.94,2.54 0 bottom
U$45  [RP23500]  8.89,24.13 0 top
U$53  [20]  2.67,19.18 270 top
U$54  [31]  2.67,16.51 270 top
U$55  [42]  2.67,13.97 270 top
U$56  [53]  2.67,11.43 270 top
U$57  [64]  2.67,8.89 270 top
U$64  [CI4]  15.11,6.35 90 top
U$66  [CO5]  14.1,3.81 0 bottom
U$67  [SCK3]  15.11,8.89 90 top
U$68  [#RST#1]  15.11,24.13 90 top
U$69  [3V30]  15.11,21.59 90 top
U$73  [PWR0]  1.9,32.3 0 top
U$74  [GND2]  2.79,22.86 270 top
U$75  [RX1]  2.67,26.67 270 top
U$76  [TX0]  2.67,29.21 270 top
Y1  3.81,6.99 180 top

### Tracks (layer width: path | path; a pad name or v marks a point on that pad's centre or on a via)
0/TX0
  Top 0.127: U2.2 4.88,15.1 4.63,14.86 3.49,14.86 3.35,15.01 3.35,17.91 2.91,18.34 2.91,28.58 2.28,29.21 J3.12
  3.3V/Horz 0.127: J3.12B J3.12
1.1V  (via drill 0.2)
  Top 0.203: C19.1 4.57,13.45 4.62,13.5 U2.6 6.18,13.5 v6.35,13.34 | C18.1 8.89,8.37 U2.23 8.89,10.03 v8.64,10.29 | v11.43,12.95 11.58,13.1 U2.39 13.45,13.1 C1.1 | v10.62,15.14 10.09,15.67 U2.50 10.09,16.59 9.83,16.85
  Top 0.305: 9.83,16.85 9.83,20.88 10.16,21.21 12.45,21.21 12.83,20.83 C20.1
  GND/Vert 0.203: v6.35,13.34 8.13,11.56 8.13,10.79 v8.64,10.29 8.89,10.54 10.03,10.54 11.43,11.94 v11.43,12.95 11.43,14.33 v10.62,15.14
  pour Top (isolate 0.127, no thermals): 10.21,20.75 10.21,19.81 13.03,19.81 13.03,20.29 12.04,20.29 12.04,20.75
1/RX0
  Top 0.127: U2.3 4.93,14.7 4.73,14.5 3.53,14.5 3.12,14.91 3.12,17.78 2.66,18.24 2.66,26.55 2.54,26.67 J3.11
  3.3V/Horz 0.127: J3.11B J3.11
2
  Top 0.127: J3.8B J3.8 2.29,19.05 2.41,18.92 2.41,16.76 2.89,16.29 2.89,14.64 3.35,14.17 4.76,14.17 4.89,14.3 U2.4
3
  Top 0.127: J3.7B J3.7 2.29,16.51 2.66,16.14 2.66,14.46 3.17,13.95 4.79,13.95 4.84,13.9 U2.5
3.3V  (via drill 0.2)
  Top 0.127: J4.4B J4.4 | R11.2 R16.2 5.97,23.74 v5.97,23.62
  Top 0.203: R5.2 R7.2 | C15.1 R5.2 | v12.83,8.57 12.7,8.45 C15.1 | J2.2 8.21,4.9 8.21,4.22 v8.03,4.04 | v4.7,15.5 v4.7,15.49 | C9.1 4.45,11.42 4.52,11.5 U2.11 6.26,11.5 v6.35,11.41 | U2.1 v4.7,15.5 | U2.30 11.69,8.02 R5.2 | C12.1 7.23,8.26 7.69,8.71 U2.20 7.69,9.91 v7.32,10.29 | 8.51,16.83 8.76,16.83 8.89,16.7 U2.53 8.89,15.49 v8.76,15.37 | 8.51,16.83 8.5,16.83 8.49,16.82 U2.54 | 8.51,16.83 8.37,16.96 C14.1 | C16.1 4.57,15.38 v4.7,15.5 | U2.38 12.95,12.7 v13.08,12.57 13.08,12.44 C2.1 | R14.2 14.22,19.43 v14.48,19.68 | U2.45 13.16,15.5 v13.25,15.42 13.33,15.5 C17.1 | R2.2 C15.1
  Top 0.305: U4.8 C29.1 11,22.03 v11,21.95
  Bottom 0.127: U5.8 v7.1,22.23 v7.11,22.23 7.11,22.6 C3.1 | R4.2 v4.45,17.78
  Bottom 0.305: C23.1 C8.2 9.97,20.64 9.97,20.93 9.72,21.18 U1.5 9.72,21.95 v11,21.95
  other vias: 10.49,16.89
  pour 3.3V/Horz (isolate 0.203): 0,33.02 17.78,33.02 17.78,0 0,0
  pour Top (isolate 0.127, no thermals): 10.46,16 10.49,16 10.49,16.54 10.62,16.66 10.62,17.7 10.16,17.7 10.16,16.87 10.46,16.56
4
  Top 0.127: J3.6B J3.6 2.29,12.95 4.57,12.95 4.72,13.1 U2.7
5
  Top 0.127: J3.5B J3.5 2.91,11.43 3.41,11.94 4.31,11.94 5.07,12.7 U2.8
6  (via drill 0.2)
  Top 0.127: J3.4B J3.4 | U2.9 6.46,12.3 v6.48,12.32
  3.3V/Horz 0.127: v6.48,12.32 6.46,12.33 4.3,12.33 2.03,10.06 2.03,9.65 J3.4
7  (via drill 0.2)
  Top 0.127: J3.3B J3.3 | U2.10 6.44,11.9 v6.48,11.87
  3.3V/Horz 0.127: v6.48,11.87 4.37,11.87 2.41,9.91 2.41,6.73 2.03,6.35 J3.3
8/TX1  (via drill 0.2)
  Top 0.127: J3.2B J3.2 | U2.12 4.62,11.1 v4.57,11.05
  3.3V/Horz 0.127: v4.57,11.05 4.06,11.05 2.67,9.65 2.67,4.32 2.16,3.81 J3.2
9/RX1  (via drill 0.2)
  Top 0.127: J3.1B J3.1 | U2.13 4.68,10.7 v4.57,10.6
  3.3V/Horz 0.127: v4.57,10.6 4.06,10.6 3.32,9.86 3.32,1.6 3,1.27 J3.1
16/SDA
  Top 0.127: U2.27 10.49,8.92 10.55,8.86 R5.1 9.97,7.29 9.97,6.03 9.39,5.45 J2.3
17/SCL
  Top 0.127: J2.4 10.39,6.86 R7.1 11.05,7.36 11.05,8.38 10.89,8.54 U2.28
20/SPI_POCI
  Top 0.127: J4.10B J4.10 15.62,6.35 14.35,7.62 14.35,8.66 12.71,10.3 U2.32
21/SPI_!CS!  (via drill 0.2)
  Top 0.127: v14.73,8.29 14.73,8.6 12.94,10.39 12.94,10.6 12.84,10.7 U2.33 | J4.12B J4.12
  GND/Vert 0.127: J4.12 15.37,1.27 14.73,1.91 v14.73,8.29
22/SPI_SCK
  Top 0.127: J4.9B J4.9 14.78,8.89 13.16,10.51 13.16,10.85 12.91,11.1 U2.34
23/SPI_PICO  (via drill 0.2)
  Top 0.127: J4.11B J4.11 | U2.35 13.01,11.5 v13.08,11.43
  GND/Vert 0.127: v13.08,11.43 15.11,9.4 15.11,4.7 16,3.81 J4.11
25/WS2812-DI  (via drill 0.2)
  Top 0.127: v15,28.5 15,30.54 U3.DI | U2.37 12.69,12.3 13.08,11.91 v13.08,11.89
  GND/Vert 0.127: v15,28.5 15,23.04 14.11,22.15 14.11,17.79 12.57,16.26 12.57,12.39 v13.08,11.89
!RESET!  (via drill 0.2)
  Top 0.127: R2.1 13.72,6.3 v13.18,5.77 v13.17,5.77 S1.3 S1.4 | J4.3B J4.3 15.47,24.13 13.84,22.5 v13.84,22.43 | U2.26 10.09,9.96 v10.29,10.16
  GND/Vert 0.127: v13.18,5.77 13.18,7.26 v10.29,10.16 12,11.87 12,16.07 13.84,17.91 v13.84,22.43
A0
  Top 0.127: J4.8B J4.8 15.49,11.43 15.24,11.68 15.24,13.97 14.97,14.24 13.44,14.24 12.71,13.5 U2.40
A1
  Top 0.127: U2.41 12.71,13.9 13.29,14.48 16,14.48 J4.7 J4.7B
A2
  Top 0.127: J4.6B J4.6 15.62,16.51 15.21,16.1 15.21,15.09 14.86,14.73 13.14,14.73 12.71,14.3 U2.42
A3
  Top 0.127: J4.5B J4.5 15.49,19.05 14.99,18.54 14.99,15.37 14.6,14.98 12.99,14.98 12.71,14.7 U2.43
BOOT  (via drill 0.2)
  Top 0.127: S2.4 3.01,3.62 v2.97,3.66 3.01,3.7 S2.3 | R15.2 v3.81,23.06
  GND/Vert 0.127: v2.97,3.66 2.97,11.79 2.85,11.91 2.85,22.1 v3.81,23.06
  Bottom 0.127: TP4.1 3.66,3.66 v2.97,3.66
FLASH_!CS!/BOOT
  Top 0.127: U2.60 6.09,16.52 5.91,16.7 5.66,16.7 5.21,17.14 5.21,19.94 4.7,20.45 4.7,21.59 3.81,22.48 U4.1 3.8,22.48 4.83,23.5 R16.1 4.82,23.88 R15.1
GND  (via drill 0.2)
  Top 0.127: C22.2 13.21,15.91 v13.22,15.9 | C17.2 14.73,17.01 14.73,18.92 15.11,19.3 v15.11,20.19
  Top 0.203: C17.2 14.15,16.43 14.15,16.38 13.67,15.9 v13.22,15.9
  Top 0.305: J5.GND 12.12,27.14 12.24,27.26 12.24,27.69 12.41,27.85 12.41,28.54 v12.45,28.57 | J5.GND2 5.67,27.21 5.54,27.34 5.54,27.69 5.37,27.85 5.37,28.67 v5.33,28.7
  other vias: 4.19,17.14 5.71,17.14 9.32,16.92 12,17.4 15.3,22.73 12.7,22.1 3.43,29.72 6.99,29.59 14,31.11 3.56,19.3 7.8,10.46 7.75,6.22 6.83,4.04 4.62,3.68 4.57,1.52 15.19,3.2 13.97,1.27 13.97,5.46 3.3,12.45 7.62,11.43 7.62,13.97 10.16,13.97 8.89,11.43 7.62,12.7 10.16,12.7 8.89,13.97 3.68,9.65 14.61,13.84 10.16,11.43 11.38,16.92 14.61,10.41 11.33,15.16 4.83,22.61 13.08,9.27 7.11,0.89 10.67,0.89 6.22,14.86 6.22,10.16 11.56,10.67 7.85,14.83 6.22,12.8 5.59,16 14.2,32.51 12.4,32.54 5.36,32.54 3.71,32.54 5.66,26.19 12.67,25.68 14.2,23.39 14.2,27.94 9.02,23.09 12.57,18.16 8.9,21.79 5.18,20.7 7.62,21.59 9.32,17.68 10.16,14.86 9.32,19.2 4.8,18.54 13.46,18.29 5.51,7.01 6.86,8.51 5.33,8.64
  pour Top (isolate 0.127, rank 2): 0,33.02 17.78,33.02 17.78,0 0,0
  pour Bottom (isolate 0.127): 0,33.02 17.78,33.02 17.78,0 0,0
  pour GND/Vert (isolate 0.203, rank 2): 0,33.02 17.78,33.02 17.78,0 0,0
  pour Top (isolate 0.127, no thermals): 11.25,15.39 11.25,17.75 12.06,17.75 12.37,18.06 12.37,19.3 13.06,19.3 13.06,17.53 12.47,16.94 11.71,16.94 11.33,16.56 11.33,15.39
N$2
  pour Top (isolate 0.127, no thermals): 10.85,16.08 10.85,17.81 10.62,18.03 10.34,18.03 10.24,18.14 10.24,18.72 12.12,18.72 12.12,18.14 12.01,18.03 11.13,18.03 10.95,17.86 10.95,16.08
N$3  (via drill 0.2)
  Top 0.203: LED1.C v3.48,31.94 v3.49,31.94
  Bottom 0.203: v3.49,31.94 3.3,31.75 PWR.2
N$9
  Top 0.127: R3.2 10.14,25.67 J5.A5
N$10
  Top 0.127: R1.2 7.14,25.63 J5.B5
N$38
  Top 0.127: R11.1 3.82,26.27 3.43,26.66 3.43,28.7 2.54,29.59 2.54,29.97 2.16,30.35 1.92,30.35 LED1.A
PSRAM_!CS!  (via drill 0.2)
  Top 0.127: U2.31 12.14,9.9 v12.14,9.47
  Bottom 0.127: v7.11,19.56 7.1,19.55 U5.1 7.1,18.91 6.85,18.66 R4.1 7.36,17.27 9.53,17.27 9.68,17.12 9.68,16.48 10.19,15.98 10.64,15.98 10.97,15.65 10.97,14.68 12.14,13.51 v12.14,9.47
QSPI-0  (via drill 0.2)
  Top 0.127: U4.5 7.62,18.67 v7.37,18.41 | v7.26,15.16 7.29,15.18 U2.57
  GND/Vert 0.127: v7.37,18.41 7.37,17.85 7.26,17.75 v7.26,15.16
  Bottom 0.127: U5.5 5.6,20.94 5.92,20.62 7.32,20.62 7.49,20.45 7.49,18.54 v7.37,18.41
QSPI-1  (via drill 0.2)
  Top 0.127: v4.32,21.21 U4.2 | v6.3,15.39 6.49,15.58 U2.59
  GND/Vert 0.127: v6.3,15.39 6.52,15.61 6.52,17.61 4.32,19.81 v4.32,21.21
  Bottom 0.127: U5.2 6.6,19.49 6.17,19.91 5.31,19.91 4.32,20.9 v4.32,21.21
QSPI-2  (via drill 0.2)
  Top 0.127: v4.7,19.94 U4.3 | v6.73,15.16 6.89,15.32 U2.58
  GND/Vert 0.127: v6.73,15.16 6.9,15.33 6.9,17.74 v4.7,19.94
  Bottom 0.127: v4.7,19.94 5.08,19.56 5.95,19.56 6.1,19.41 U5.3
QSPI-3  (via drill 0.2)
  Top 0.127: v8.26,21.21 U4.7 | v8.26,15.24 8.09,15.4 U2.55
  GND/Vert 0.127: v8.26,15.24 v8.26,21.21
  Bottom 0.127: U5.7 6.6,21.44 6.86,21.18 8.23,21.18 v8.26,21.21
QSPI-CLK  (via drill 0.2)
  Top 0.127: U4.6 8,19.94 v7.87,19.81 | v7.72,15.36 7.69,15.39 U2.56
  GND/Vert 0.127: v7.72,15.36 7.72,18.16 7.87,18.31 v7.87,19.81
  Bottom 0.127: v7.87,19.81 7.87,20.7 7.67,20.9 6.4,20.9 6.1,21.2 U5.6
RAW  (via drill 0.2)
  Top 0.127: J4.1B J4.1 16.51,30.23 U3.VCC
  3.3V/Horz 0.305: v7.62,24.64 7.62,29.04 8.19,29.6 14.85,29.6 15.24,29.21 J4.1
  Bottom 0.305: v7.62,24.64 D2.C 8.96,23.94 | C7.2 8.96,23.94 | 8.96,23.94 9.18,24.16 U1.1 9.72,23.3 9.91,23.11 11.43,23.11 11.62,23.3 U1.3
RP_D1+  (via drill 0.2)
  Top 0.127: R13.2 13.21,23.76 v13.21,23.37 | v9.27,15.11 9.29,15.13 U2.52
  GND/Vert 0.127: v13.21,23.37 13.08,23.24 11.3,23.24 8.71,20.65 8.71,16 9.27,15.44 v9.27,15.11
RP_D1-  (via drill 0.2)
  Top 0.127: R12.2 13.72,23.76 v13.72,23.37 | U2.51 9.69,15.53 9.72,15.49 v9.72,15.11
  GND/Vert 0.127: v13.72,23.37 13.34,22.99 11.37,22.99 8.96,20.58 8.96,16.07 9.72,15.31 v9.72,15.11
RP_D+  (via drill 0.2)
  Top 0.127: v13.21,25.65 13.21,25.27 R13.1 | v8.26,27.94 8.14,27.82 J5.B6 8.13,27 8.13,26.42 8.27,26.27 8.97,26.27 9.14,26.45 J5.A6
  3.3V/Horz 0.127: v13.21,25.65 12.75,26.11 9.5,26.11 8.53,27.08 8.53,27.66 v8.26,27.94
  Bottom 0.127: v8.26,27.94 8,28.19 JP14.D+
RP_D-  (via drill 0.2)
  Top 0.127: R12.1 13.72,25.27 v13.72,25.65 | J5.B7 9.64,27.77 9.47,27.94 v8.76,27.94 8.64,27.82 J5.A7
  3.3V/Horz 0.127: v13.72,25.65 13.02,26.35 9.59,26.35 8.76,27.18 v8.76,27.94
  Bottom 0.127: v8.76,27.94 9.78,28.96 JP14.D-
SHLD
  Bottom 0.305: SHLD.1 12.69,26.81 13.21,27.33 J5.SHLD1
  pour GND/Vert (isolate 0.203): 4.45,31.88 4.45,27.43 13.34,27.43 13.34,31.88
SWDCK  (via drill 0.2)
  Top 0.127: U2.24 9.29,10.14 v9.27,10.16
  Bottom 0.127: TP1.1 8.89,9.78 v9.27,10.16
SWDIO  (via drill 0.2)
  Top 0.127: U2.25 9.69,10.07 v9.78,10.16
  Bottom 0.127: TP2.1 9.78,8 v9.78,10.16
USB_RAW
  Bottom 0.305: F1.2 5.21,24.63 5.95,24.63 D2.A
V_USB  (via drill 0.2)
  Top 0.305: J5.VBUS1 11.34,27.66 11.15,27.85 v11.15,28.6 11.05,28.7 7.11,28.7 6.63,28.22 6.63,27.85 6.44,27.66 J5.VBUS2 6.44,26.01 v6.15,25.72
  Bottom 0.305: v11.15,28.6 11.15,28.86 11.49,29.2 11.49,31.3 JP14.VBUS | F1.1 6.09,25.66 v6.15,25.72
VDDA
  Top 0.203: U2.44 11.9,15.1 11.69,15.31 11.69,15.66 U2.46 11.69,16.52 11.94,16.76 12.45,16.76 C22.1 13.22,17.53 R14.1
WS2812-DO  (via drill 0.2)
  Top 0.127: v17.14,30.86 17.14,32.13 16.86,32.41 U3.DO
  Bottom 0.127: TP3.1 17.14,31.11 v17.14,30.86
X1A
  Top 0.127: U2.22 8.49,8.5 8.38,8.39 R10.2
X1B
  Top 0.127: Y1.P1 3.72,5.54 5.91,5.54 C11.2 8.37,6.86 R10.1
X2
  Top 0.127: U2.21 8.09,8.5 7.82,8.23 7.82,7.57 7.62,7.37 4.99,7.37 Y1.P3 4.66,8.79 C13.2

### Text on the board
Bottom: v10
Measures: Units in Inches
tDocu: 4-layer / JLC7628 Stackup / Material: TG135-140 / 1oz outer layers / 0.5oz inner layers / Board thickness: 0.8mm / Soldermask: Red / Silkscreen: White / Surface Finish: Lead-Free HASL / Castellated Leads | Dryw Wade | Based on design by: Nathan Seidle